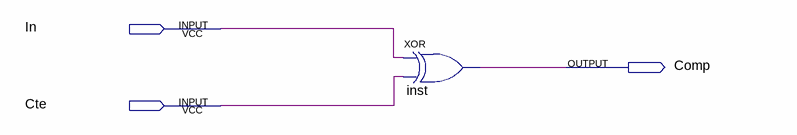
[diagram p0: schematic sheet]
// Quartus schematic Complemento.bdf as structural Verilog: 1 symbols, 3 pins
module Complemento (
  input  In,
  input  Cte,
  output Comp
);

  xor inst (Comp, In, Cte);
endmodule
